# Altium project 8SoundsUSB-MIC.PrjPcb
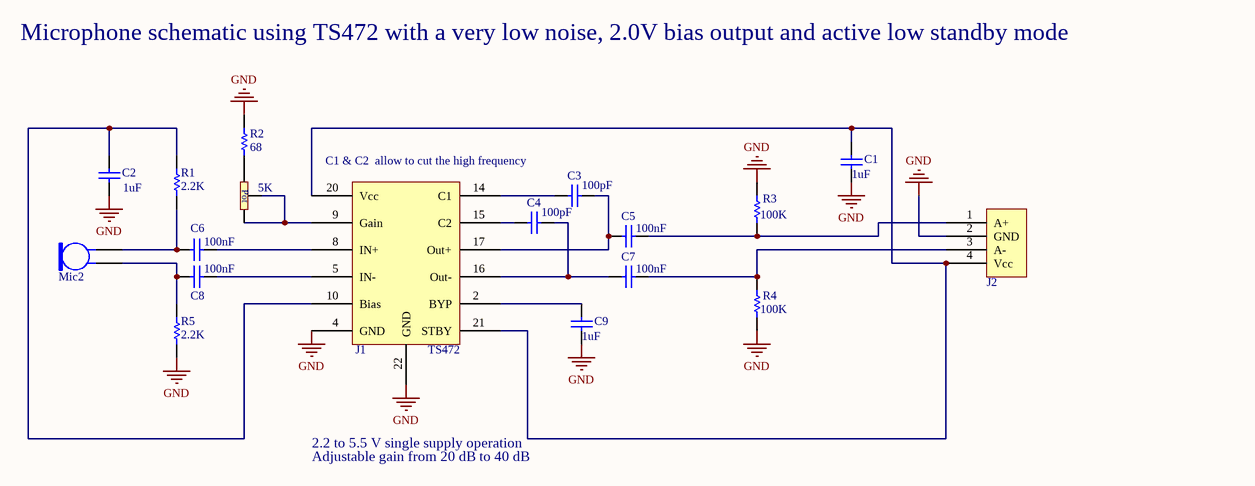
[diagram p0: 8SoundsUSB-MIC.SchDoc]
1 sheet, 18 parts. Net scope: global (net labels, ports and power ports of the same name join across sheets).
Board file: 8SoundsUSB-MIC.PcbDoc

## Sheet 8SoundsUSB-MIC.SchDoc: 8SoundsUSB-MIC
size A3; Date: 2011-12-05; CheckedBy: Checked by : S.Choquette; Author: M.Bandou; Revision: 2.0; SheetNumber: 1; SheetTotal: 1

### Parts
C1  value 1uF  [C0603]  (hidden comment: Cap)
C2  value 1uF  [C0603]  (hidden comment: Cap)
C3  value 100pF  [C0603]  (hidden comment: Cap)
C4  value 100pF  [C0603]  (hidden comment: Cap)
C5  value 100nF  [C0603]  (hidden comment: Cap)
C6  value 100nF  [C0603]  (hidden comment: Cap)
C7  value 100nF  [C0603]  (hidden comment: Cap)
C8  value 100nF  [C0603]  (hidden comment: Cap)
C9  value 1uF  [C0603]  (hidden comment: Cap)
J1  TS472  [TS472]
J2  RJ-11-MIC  [RJ11 Micro]  (value not drawn)
MK1  Mic2  [Mic]
pot  (no value)  [CT-94]
R1  value 2.2K  [R0603]  (hidden comment: Res1)
R2  value 68  [R0603]  (hidden comment: Res2)
R3  value 100K  [R0603]  (hidden comment: Res1)
R4  value 100K  [R0603]  (hidden comment: Res1)
R5  value 2.2K  [R0603]  (hidden comment: Res1)

### Nets
GND: C1.2 C2.2 C9.2 J1.4(GND) J1.22(GND) J2.2(GND) R2.1 R3.2 R4.2 R5.2
NetC1_1: C1.1 J1.20(Vcc) J1.21(STBY) J2.4(Vcc)
NetC2_1: C2.1 J1.10(Bias) R1.1
NetC3_1: C3.1 J1.14(C1)
NetC3_2: C3.2 C5.1 J1.17(Out+)
NetC4_1: C4.1 J1.15(C2)
NetC4_2: C4.2 C7.1 J1.16(Out-)
NetC5_2: C5.2 J2.1(A+) R3.1
NetC6_1: C6.1 MK1.2 R1.2
NetC6_2: C6.2 J1.8(IN+)
NetC7_2: C7.2 J2.3(A-) R4.1
NetC8_1: C8.1 MK1.1 R5.1
NetC8_2: C8.2 J1.5(IN-)
NetC9_1: C9.1 J1.2(BYP)
NetJ1_9: J1.9(Gain) pot.2 pot.3
Netpot_1: pot.1 R2.2

### Notes on the sheet
- Microphone schematic using TS472 with a very low noise, 2.0V bias output and active low standby mode
- C1 & C2  allow to cut the high frequency
- Adjustable gain from 20 dB to 40 dB
- 2.2 to 5.5 V single supply operation
- Title:
- Date:
- Sheet:
- of
- Author:
- Team members:
- M.Bandou, A.Béland, G.Cayer,
- Rev.:
- Released under Creative Common Licence Attribution-ShareAlike 2.5 Canada (CC BY-SA 2.5)
- S.Choquette, F.Gosselin,
- F.Robitaillle, D.Telly.Kizito
- Info.: http://sourceforge.net/projects/eightsoundsusb/
- (in symbol CT-94) Pot; 5K

### Library data of the parts
C1 C2 C9 = Cap: Capacitor; Part Number: GRM188R61A105KA61D; Manufacturer: Murata Electronics North America; Published: 8-Jun-2000; LatestRevisionDate: 17-Jul-2002; LatestRevisionNote: Re-released for DXP Platform.; PackageReference: RAD-0.3; Publisher: Altium Limited
C3 C4 = Cap: Capacitor; Part Number: 0603YC101KAT2A; Manufacturer: AVX Corporation; Published: 8-Jun-2000; LatestRevisionDate: 17-Jul-2002; LatestRevisionNote: Re-released for DXP Platform.; PackageReference: RAD-0.3; Publisher: Altium Limited
C5-C8 = Cap: Capacitor; Part Number: C0603C104K8RACTU; Manufacturer: Kemet; Published: 8-Jun-2000; LatestRevisionDate: 17-Jul-2002; LatestRevisionNote: Re-released for DXP Platform.; PackageReference: RAD-0.3; Publisher: Altium Limited
J1 = TS472: Manufacturer: STMicroelectronics; Part Number: TS472
J2 = RJ-11-MIC: Part Number: 95503-6651; Manufacturer: Molex Connector Corporation
MK1 = Mic2: Microphone; Part Number: CMA-4544PF-W; Manufacturer: CUI Inc; Published: 24-Mar-1999; LatestRevisionDate: 17-Jul-2002; LatestRevisionNote: Re-released for DXP Platform.; PackageReference: PIN2; Publisher: Altium Limited
pot = CT-94: Part Number: CT94EW502; Manufacturer: Copal Electronics Inc
R1 R5 = Res1: Resistor; Part Number: RC0603JR-072K2L; Manufacturer: Yageo; Published: 8-Jun-2000; LatestRevisionDate: 17-Jul-2002; LatestRevisionNote: Re-released for DXP Platform.; PackageReference: AXIAL-0.3; Publisher: Altium Limited
R2 = Res1: Resistor; Part Number: RC0603JR-0768RL; Manufacturer: Yageo; Published: 8-Jun-2000; LatestRevisionDate: 17-Jul-2002; LatestRevisionNote: Re-released for DXP Platform.; PackageReference: AXIAL-0.3; Publisher: Altium Limited
R3 R4 = Res1: Resistor; Part Number: RC0603JR-07100KL; Manufacturer: Yageo; Published: 8-Jun-2000; LatestRevisionDate: 17-Jul-2002; LatestRevisionNote: Re-released for DXP Platform.; PackageReference: AXIAL-0.3; Publisher: Altium Limited